# EasyEDA schematic Microcontroller board(Photodiode plate).json
TITLE: Sheet_1; REV: 1.0; Date: 2024-04-23; Sheet: 1/1; Company: Your Company
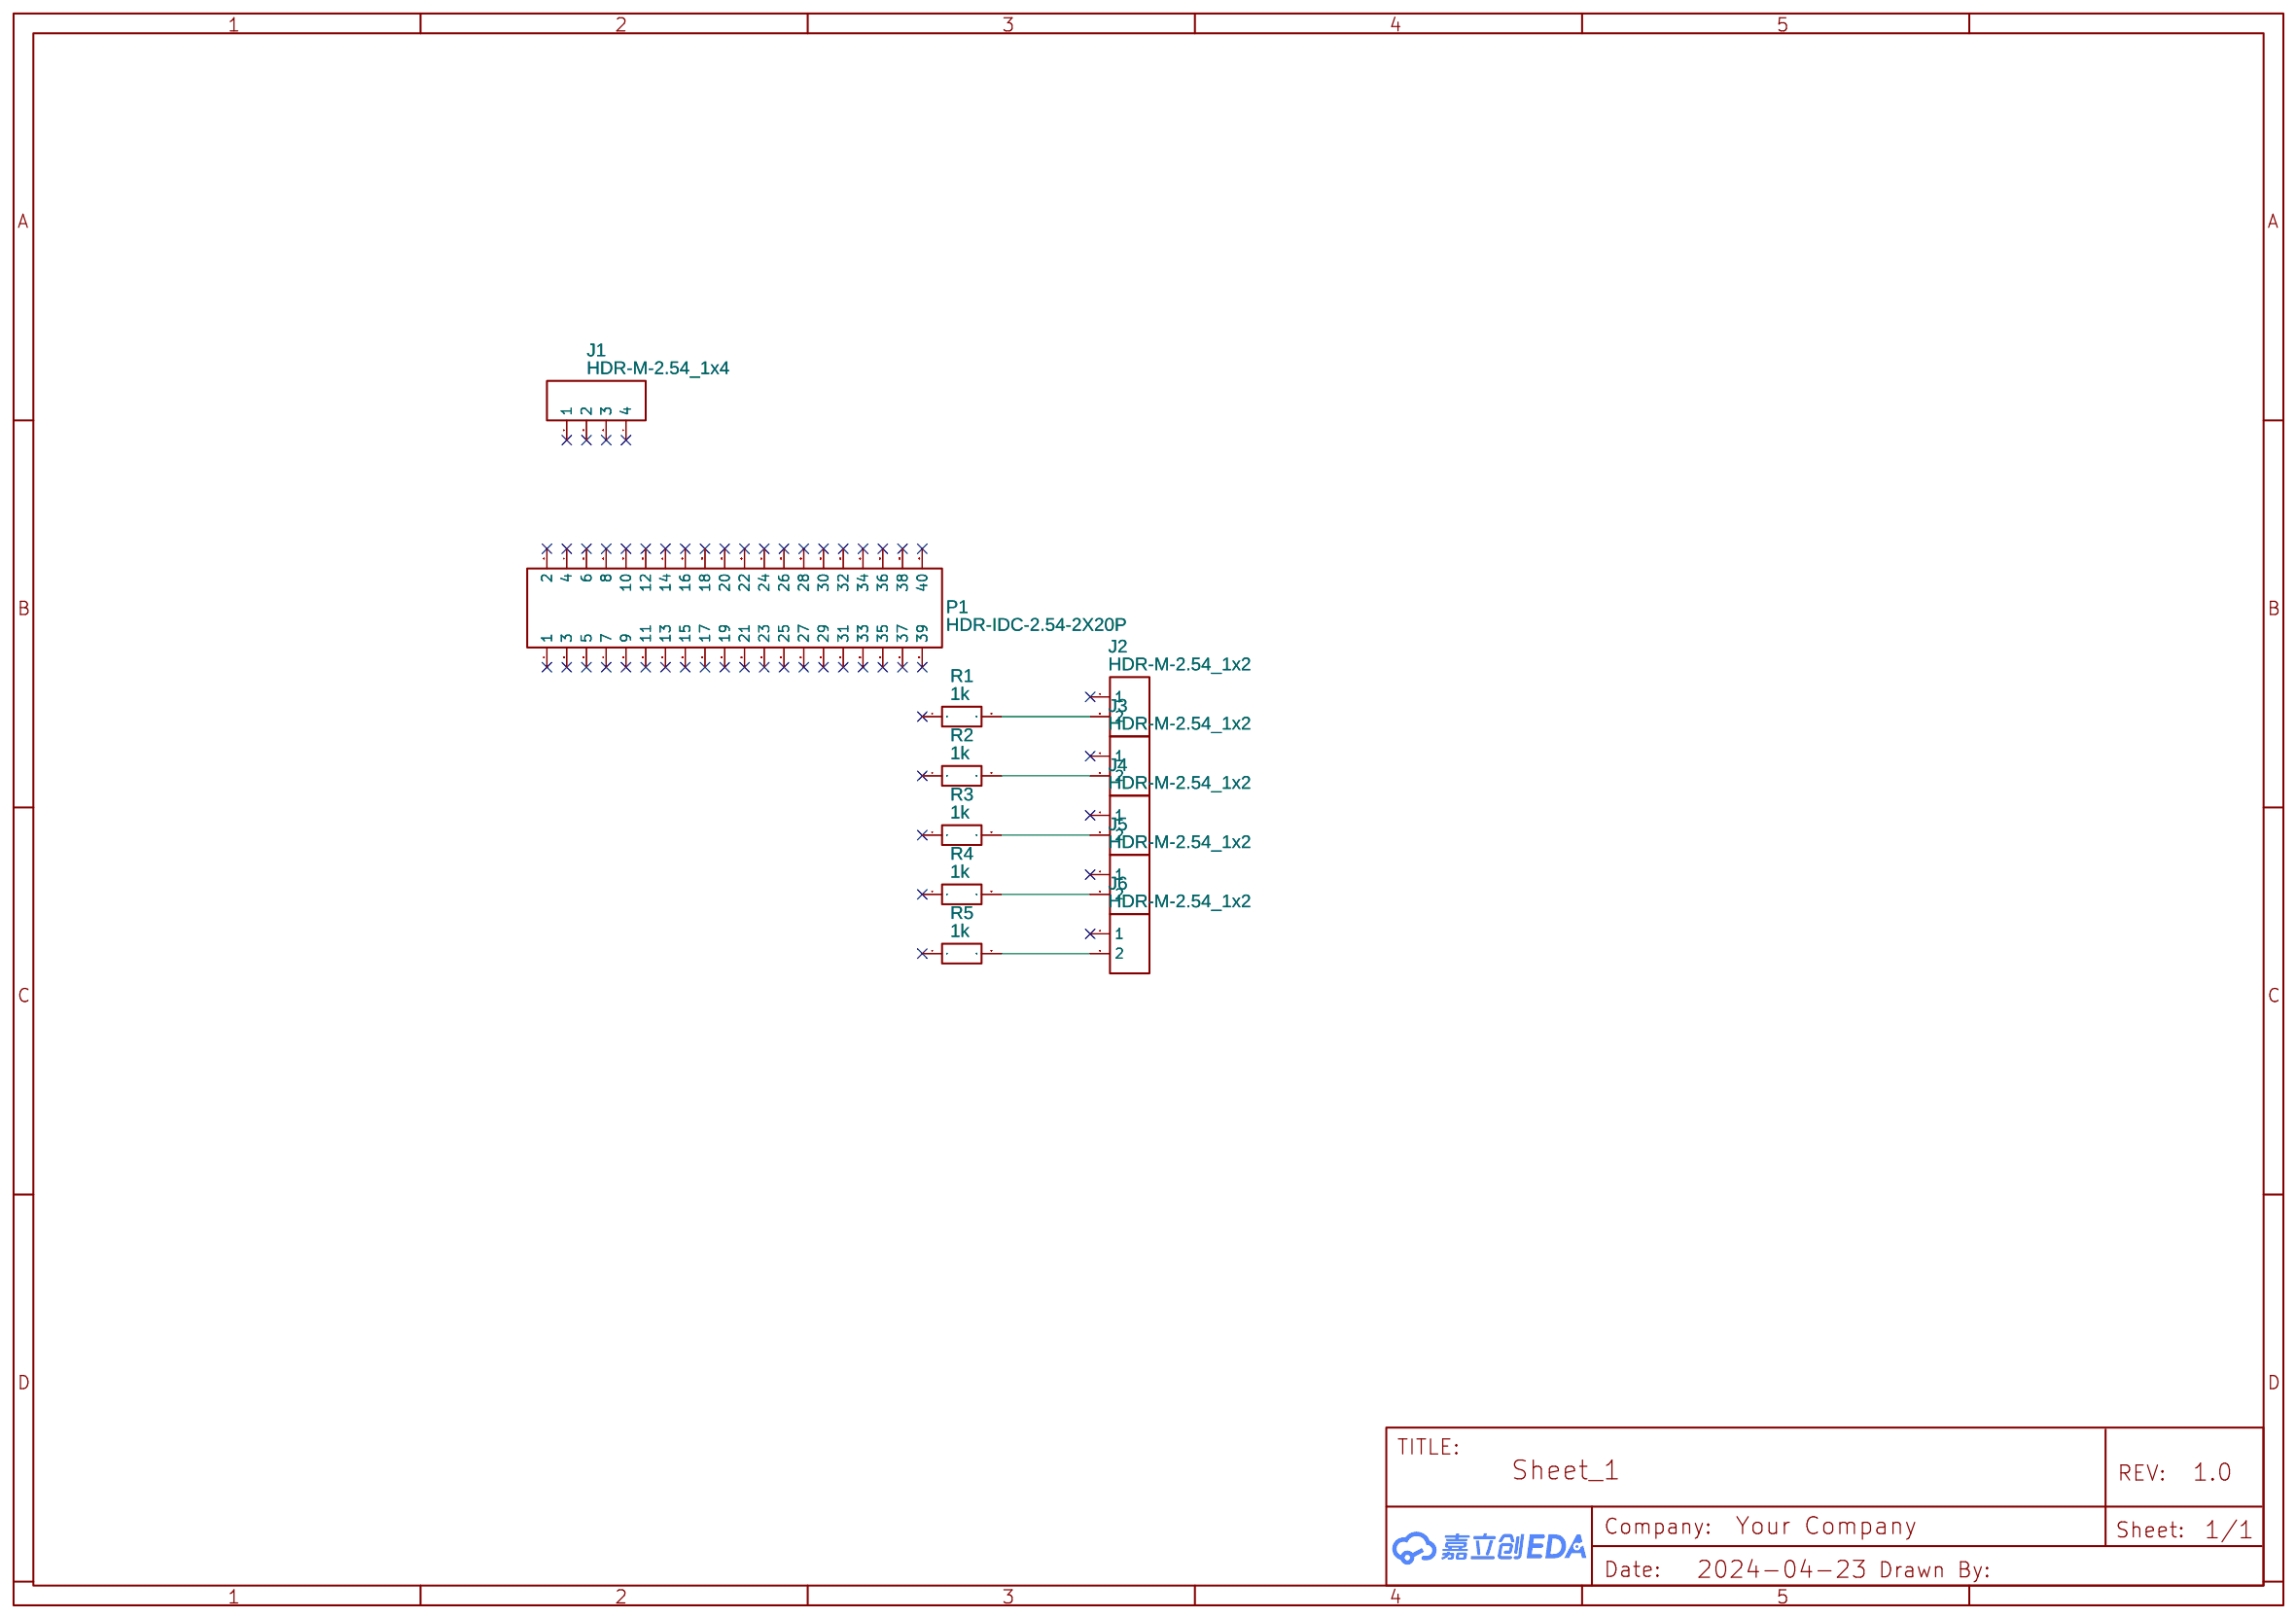
[diagram p0: schematic sheet]

## Parts
J1  HDR-M-2.54_1x4  [HDR-M-2.54_1X4]
J2  HDR-M-2.54_1x2  [HDR-M-2.54_1X2]
J3  HDR-M-2.54_1x2  [HDR-M-2.54_1X2]
J4  HDR-M-2.54_1x2  [HDR-M-2.54_1X2]
J5  HDR-M-2.54_1x2  [HDR-M-2.54_1X2]
J6  HDR-M-2.54_1x2  [HDR-M-2.54_1X2]
P1  HDR-IDC-2.54-2X20P  [IDC-TH_40P-P2.54_C9138]
R1  1k  [R0805]
R2  1k  [R0805]
R3  1k  [R0805]
R4  1k  [R0805]
R5  1k  [R0805]

## Library data of the parts
J1 = HDR-M-2.54_1x4: Supplier Part: C124378; Supplier: LCSC; Contributor: LCEDA_Lib
J2-J6 = HDR-M-2.54_1x2: Supplier Part: C124375; Supplier: LCSC; Contributor: LCEDA_Lib
P1 = HDR-IDC-2.54-2X20P: Supplier: LCSC; Manufacturer: BOOMELE; Manufacturer Part: IDC Box 2X20 2.54MM; image: //image.lceda.cn/szlcsc/C9138.jpg; Supplier Part: C9138
R1-R5 = R_0805_EU: Contributor: LCEDA_Lib

## Nets
Net-(J2-2): J2.2 R1.2
Net-(J3-2): J3.2 R2.2
Net-(J4-2): J4.2 R3.2
Net-(J5-2): J5.2 R4.2
Net-(J6-2): J6.2 R5.2

Not connected (* = marked no-connect by the designer): J1 1* 2* 3* 4*; J2 1*; J3 1*; J4 1*; J5 1*; J6 1*; P1 1* 2* 3* 4* 5* 6* 7* 8* 9* 10* 11* 12* 13* 14* 15* 16* 17* 18* 19* 20* 21* 22* 23* 24* 25* 26* 27* 28* 29* 30* 31* 32* 33* 34* 35* 36* 37* 38* 39* 40*; R1 1*; R2 1*; R3 1*; R4 1*; R5 1*
